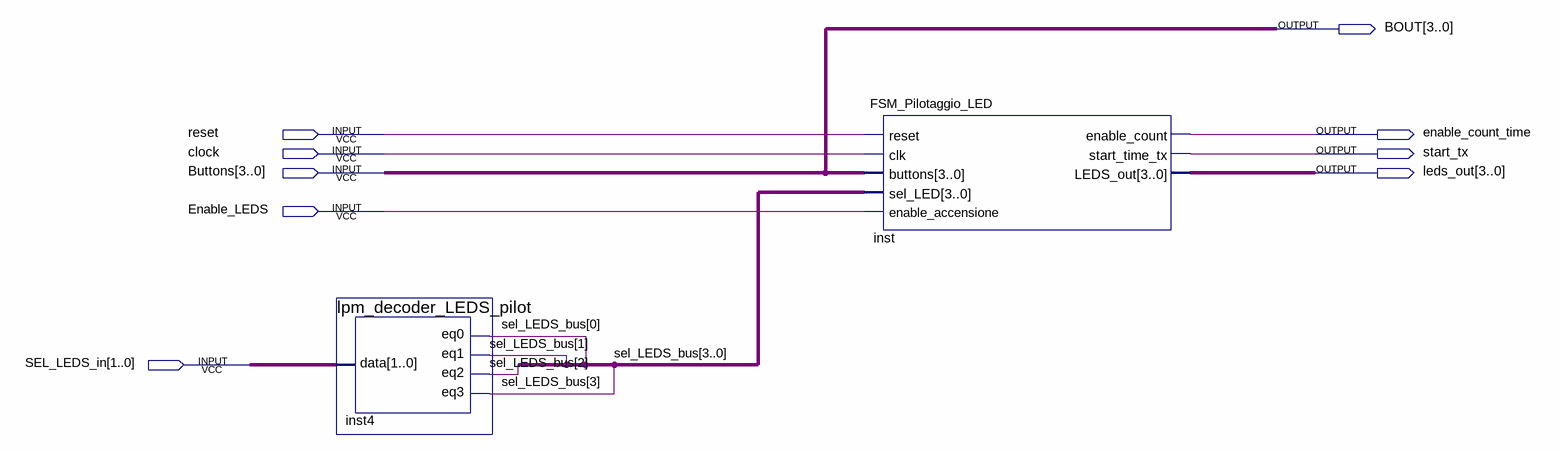
[diagram p0: schematic sheet]
// Quartus schematic Pilotaggio_LED2.bdf as structural Verilog: 2 symbols, 9 pins
module Pilotaggio_LED2 (
  input  reset,
  input  clock,
  input  [3:0] Buttons,
  input  Enable_LEDS,
  input  [1:0] SEL_LEDS_in,
  output [3:0] BOUT,
  output enable_count_time,
  output start_tx,
  output [3:0] leds_out
);

  wire [3:0] sel_LEDS_bus;

  lpm_decoder_LEDS_pilot inst4 (
    .data(SEL_LEDS_in), .eq0(sel_LEDS_bus[0]), .eq1(sel_LEDS_bus[1]), .eq2(sel_LEDS_bus[2]),
    .eq3(sel_LEDS_bus[3]));
  FSM_Pilotaggio_LED inst (
    .reset(reset), .clk(clock), .buttons(Buttons), .sel_LED(sel_LEDS_bus), .enable_accensione(Enable_LEDS),
    .enable_count(enable_count_time), .start_time_tx(start_tx), .LEDS_out(leds_out));

  assign BOUT = Buttons;
endmodule
